# EAGLE schematic Driver (EAGLE 9.6.2)
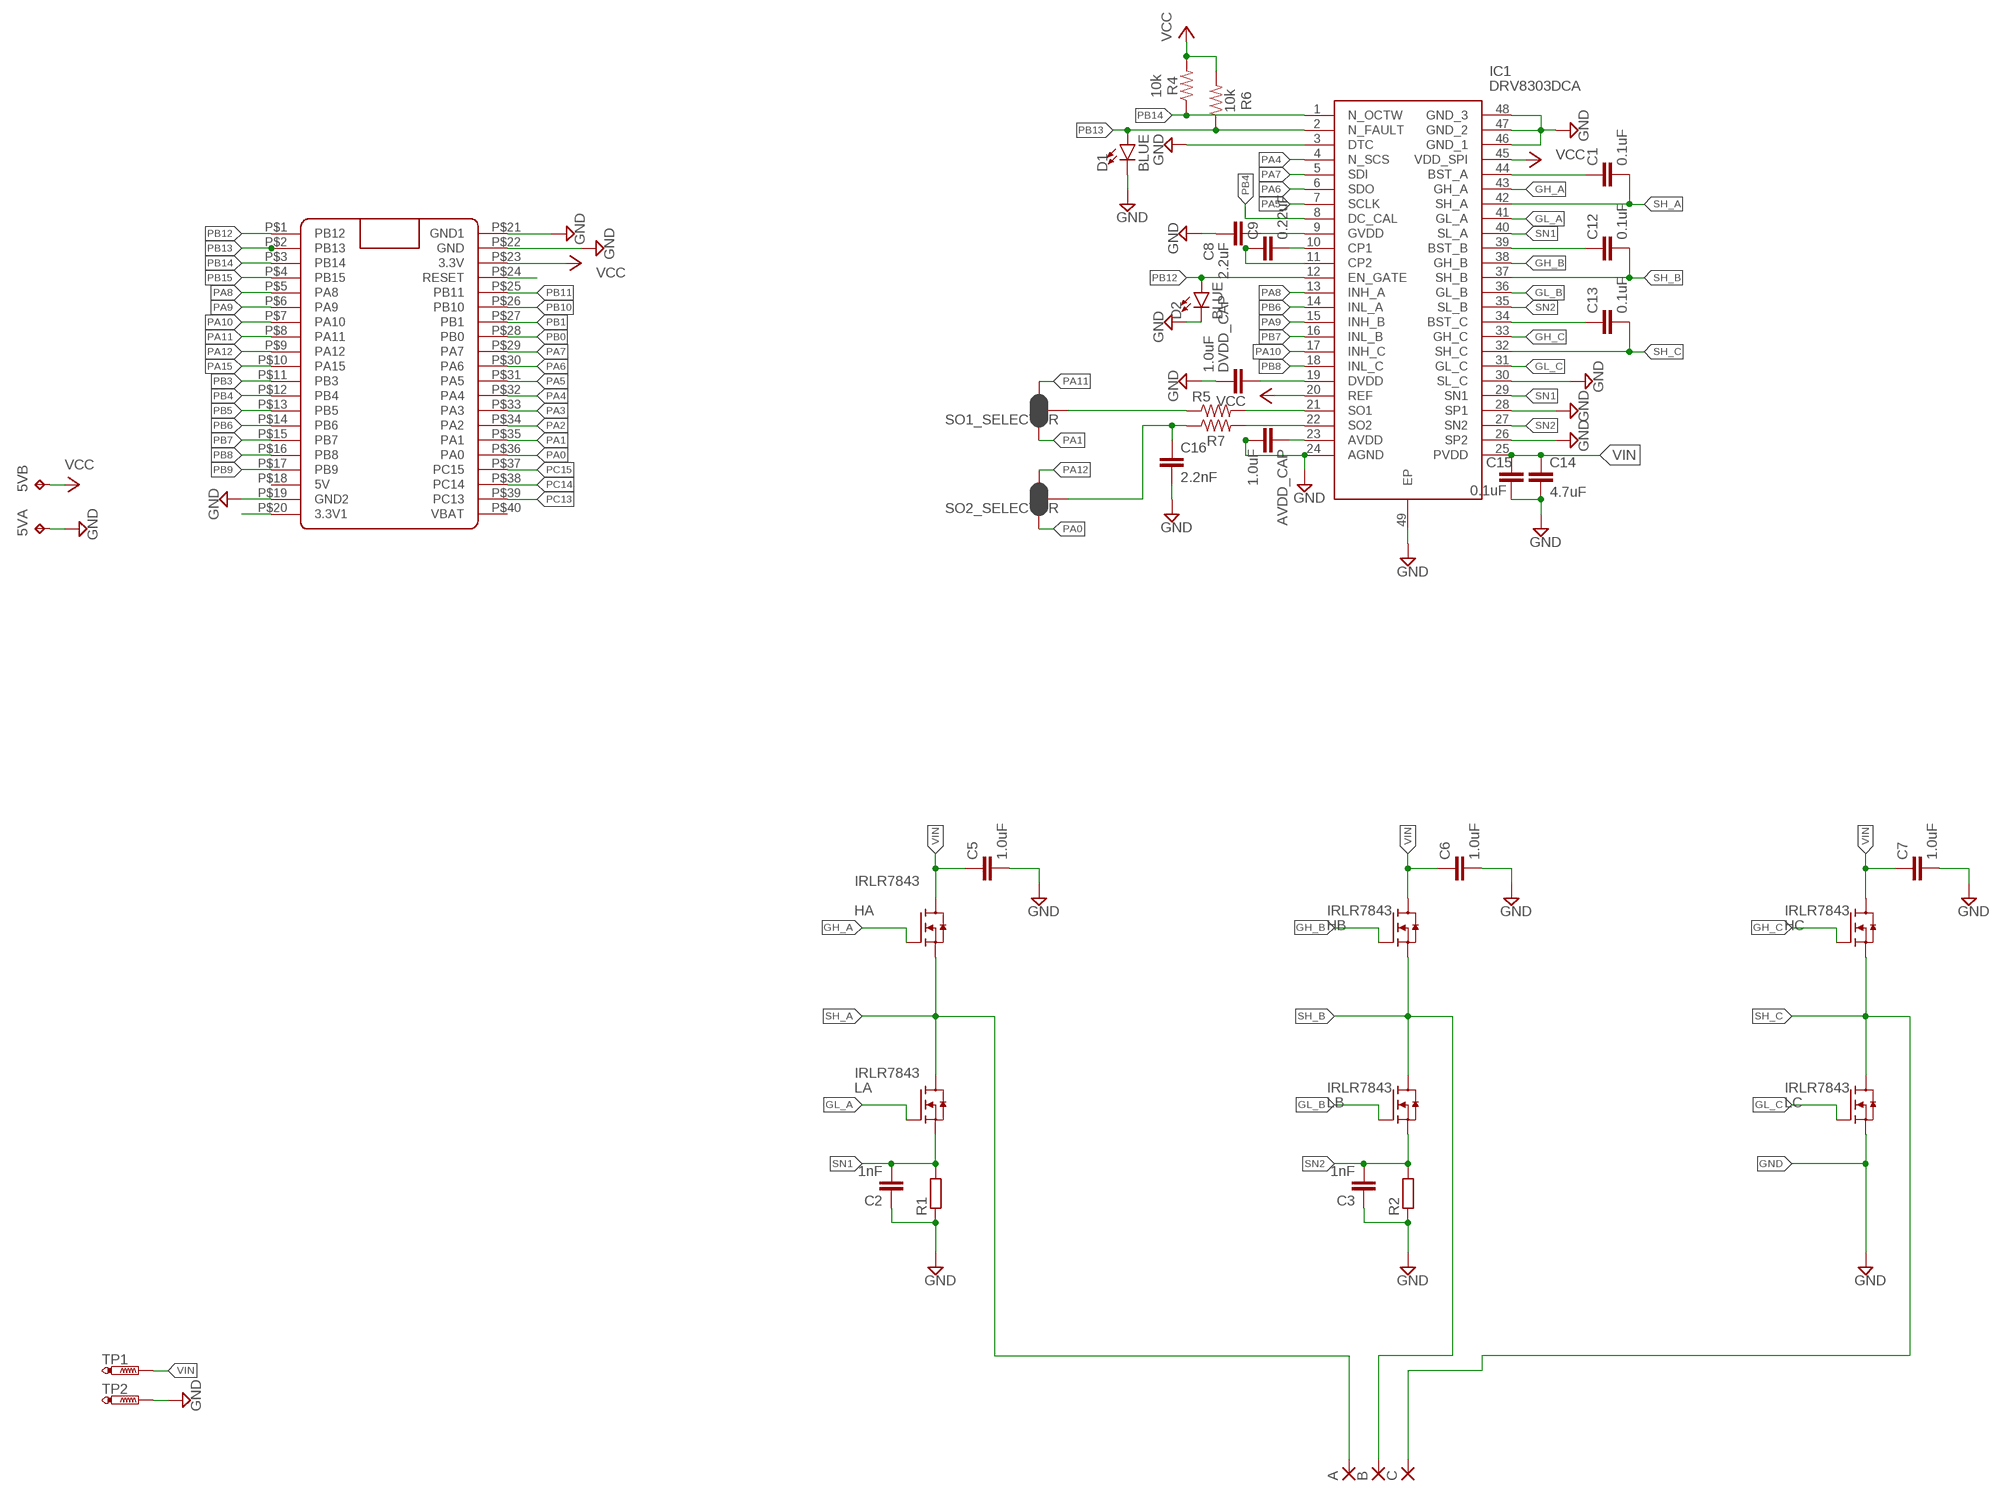
[diagram p0: schematic, sheet 1]

## Parts
5V  TP2P2-38-17  [P2-38-17]
A  SMD5  [SMD2,54-5,08]
AVDD_CAP  1.0uF  1.0UF-0603-16V-10%  [0603]
B  SMD5  [SMD2,54-5,08]
C  SMD5  [SMD2,54-5,08]
C1  0.1uF  0.1UF-0603-25V-(+80/-20%)  [0603]
C2  1nF  1.0NF/1000PF-0603-50V-10%  [0603]
C3  1nF  1.0NF/1000PF-0603-50V-10%  [0603]
C5  1.0uF  1.0UF-0603-16V-10%-X7R  [0603]
C6  1.0uF  1.0UF-0603-16V-10%-X7R  [0603]
C7  1.0uF  1.0UF-0603-16V-10%-X7R  [0603]
C8  2.2uF  2.2UF-0603-10V-20%  [0603]
C9  0.22uF  0.22UF-0603-25V-10%  [0603]
C12  0.1uF  0.1UF-0603-25V-(+80/-20%)  [0603]
C13  0.1uF  0.1UF-0603-25V-(+80/-20%)  [0603]
C14  4.7uF  4.7UF-0603-35V-(20%)  [0603]
C15  0.1uF  0.1UF-0603-25V-(+80/-20%)  [0603]
C16  2.2nF  2.2NF/2200PF-0603-50V-10%  [0603]
D1  BLUE  LED-BLUE0603  [LED-0603]
D2  BLUE  LED-BLUE0603  [LED-0603]
DVDD_CAP  1.0uF  1.0UF-0603-16V-10%  [0603]
HA  IRLR7843  [TO252]
HB  IRLR7843  [TO252]
HC  IRLR7843  [TO252]
IC1  DRV8303DCA  [SOP50P810X120-49N]
LA  IRLR7843  [TO252]
LB  IRLR7843  [TO252]
LC  IRLR7843  [TO252]
R1  R-EU_R2512  [R2512]
R2  R-EU_R2512  [R2512]
R4  10k  10KOHM-0603-1/10W-1%  [0603]
R5  0  0OHM-0603-1/10W  [0603]
R6  10k  10KOHM-0603-1/10W-1%  [0603]
R7  0  0OHM-0603-1/10W  [0603]
SO1_SELECTOR  JUMPER-SMT_3_2-NC_PASTE_SILK  [SMT-JUMPER_3_2-NC_PASTE_SILK]
SO2_SELECTOR  JUMPER-SMT_3_2-NC_PASTE_SILK  [SMT-JUMPER_3_2-NC_PASTE_SILK]
TP1  PTR1PAD1-20Y  [P1-20Y]
TP2  PTR1PAD1-20Y  [P1-20Y]
U$1  BLUE_PILLADVANCED  [BLUE_PILL_ADV]

## Nets
GH_A: HA.1(G) IC1.43(GH_A)
GH_B: HB.1(G) IC1.38(GH_B)
GH_C: HC.1(G) IC1.33(GH_C)
GL_A: IC1.41(GL_A) LA.1(G)
GL_B: IC1.36(GL_B) LB.1(G)
GL_C: IC1.31(GL_C) LC.1(G)
GND: 5V.TP-1 AVDD_CAP.2 C2.1 C3.1 C5.2 C6.2 C7.2 C8.2 C14.2 C15.2 C16.2 D1.C D2.C DVDD_CAP.1 IC1.3(DTC) IC1.24(AGND) IC1.26(SP2) IC1.28(SP1) IC1.30(SL_C) IC1.46(GND_1) IC1.47(GND_2) IC1.48(GND_3) IC1.49(EP) LC.2(S) R1.1 R2.1 TP2.TP U$1.P$19(GND2) U$1.P$21(GND1) U$1.P$22(GND)
N$1: IC1.21(SO1) R5.2
N$2: C1.1 IC1.44(BST_A)
N$3: IC1.22(SO2) R7.2
N$4: U$1.P$24(RESET)
N$9: C12.1 IC1.39(BST_B)
N$14: C13.1 IC1.34(BST_C)
N$32: C8.1 IC1.9(GVDD)
N$33: C9.2 IC1.10(CP1)
N$34: C9.1 IC1.11(CP2)
N$40: U$1.P$20(3.3V1)
N$43: DVDD_CAP.2 IC1.19(DVDD)
N$47: AVDD_CAP.1 IC1.23(AVDD)
PA0: SO2_SELECTOR.1 U$1.P$36(PA0)
PA1: SO1_SELECTOR.1 U$1.P$35(PA1)
PA2: U$1.P$34(PA2)
PA3: U$1.P$33(PA3)
PA4: IC1.4(N_SCS) U$1.P$32(PA4)
PA5: IC1.7(SCLK) U$1.P$31(PA5)
PA6: IC1.6(SDO) U$1.P$30(PA6)
PA7: IC1.5(SDI) U$1.P$29(PA7)
PA8: IC1.13(INH_A) U$1.P$5(PA8)
PA9: IC1.15(INH_B) U$1.P$6(PA9)
PA10: IC1.17(INH_C) U$1.P$7(PA10)
PA11: SO1_SELECTOR.3 U$1.P$8(PA11)
PA12: SO2_SELECTOR.3 U$1.P$9(PA12)
PA15: U$1.P$10(PA15)
PB0: U$1.P$28(PB0)
PB1: U$1.P$27(PB1)
PB3: U$1.P$11(PB3)
PB4: IC1.8(DC_CAL) U$1.P$12(PB4)
PB5: U$1.P$13(PB5)
PB6: IC1.14(INL_A) U$1.P$14(PB6)
PB7: IC1.16(INL_B) U$1.P$15(PB7)
PB8: IC1.18(INL_C) U$1.P$16(PB8)
PB9: U$1.P$17(PB9)
PB10: U$1.P$26(PB10)
PB11: U$1.P$25(PB11)
PB12: D2.A IC1.12(EN_GATE) U$1.P$1(PB12)
PB13: D1.A IC1.2(N_FAULT) R6.1 U$1.P$2(PB13)
PB14: IC1.1(N_OCTW) R4.1 U$1.P$3(PB14)
PB15: U$1.P$4(PB15)
PC13: U$1.P$39(PC13)
PC14: U$1.P$38(PC14)
PC15: U$1.P$37(PC15)
SH_A: A.1(P) C1.2 HA.2(S) IC1.42(SH_A) LA.3(D)
SH_B: B.1(P) C12.2 HB.2(S) IC1.37(SH_B) LB.3(D)
SH_C: C13.2 C.1(P) HC.2(S) IC1.32(SH_C) LC.3(D)
SN1: C2.2 IC1.29(SN1) IC1.40(SL_A) LA.2(S) R1.2
SN2: C3.2 IC1.27(SN2) IC1.35(SL_B) LB.2(S) R2.2
SO1: R5.1 SO1_SELECTOR.2
SO2: C16.1 R7.1 SO2_SELECTOR.2
VCC: 5V.TP-2 IC1.20(REF) IC1.45(VDD_SPI) R4.2 R6.2 U$1.P$23(3.3V)
VIN: C5.1 C6.1 C7.1 C14.1 C15.1 HA.3(D) HB.3(D) HC.3(D) IC1.25(PVDD) TP1.TP
Unconnected: U$1.P$18(5V) U$1.P$40(VBAT)

## Library data of the parts
5V = testpad:TP2: Test pad
A B C = wirepad:SMD5: SMD PAD
AVDD_CAP DVDD_CAP = SparkFun-Capacitors:1.0UF: 1µF ceramic capacitors A capacitor is a passive two-terminal electrical component used to store electrical energy temporarily in an electric field.; PROD_ID: CAP-00868
C1 C12 C13 C15 = SparkFun-Capacitors:0.1UF: 0.1µF ceramic capacitors A capacitor is a passive two-terminal electrical component used to store electrical energy temporarily in an electric field.; PROD_ID: CAP-00810
C2 C3 = SparkFun-Capacitors:1.0NF/1000PF: 1nF/1,000pF ceramic capacitors A capacitor is a passive two-terminal electrical component used to store electrical energy temporarily in an electric field.; PROD_ID: CAP-07886
C5-C7 = SparkFun-Capacitors:1.0UF: 1µF ceramic capacitors A capacitor is a passive two-terminal electrical component used to store electrical energy temporarily in an electric field.; PROD_ID: CAP-13930
C8 = SparkFun-Capacitors:2.2UF: 2.2µF ceramic capacitors A capacitor is a passive two-terminal electrical component used to store electrical energy temporarily in an electric field.; PROD_ID: CAP-07888
C9 = SparkFun-Capacitors:0.22UF: 0.22µF ceramic capacitors A capacitor is a passive two-terminal electrical component used to store electrical energy temporarily in an electric field.; PROD_ID: CAP-07822
C14 = SparkFun-Capacitors:4.7UF: 4.7µF ceramic capacitors A capacitor is a passive two-terminal electrical component used to store electrical energy temporarily in an electric field.; PROD_ID: CAP-14106
C16 = SparkFun-Capacitors:2.2NF/2200PF: 2.2nF/2,200pF ceramic capacitors A capacitor is a passive two-terminal electrical component used to store electrical energy temporarily in an electric field.; PROD_ID: CAP-07877
D1 D2 = SparkFun-LED:LED-BLUE: Blue SMD LED Used in manufacturing of various products at SparkFun Packages: 0603 - SMD 0603 package [Product Link] <http://www.digikey.com/product-detail/en/SMLE12BC7TT86/511-1589-2-ND/1641808> 1206 - SMD1206 package [Product Link] <http://www.digikey.com/product-detail/en/lite-on-inc/LTST-C150TBKT/160-1643-1-ND/573584> SparkFun Products: ESP8266 Thing-Dev Board <https://www.sparkfun.com/products/13711> RedBoard <https://www.sparkfun.com/products/12757>; PROD_ID: DIO-08575
HA HB HC LA LB LC = BLDC project:IRLR7843
IC1 = DRV8303DCA:DRV8303DCA: Texas Instruments DRV8303DCA, Three-Phase Gate Driver With Dual-Current Shunt Source: Datasheet <https://componentsearchengine.com/Datasheets/2/DRV8303DCA.pdf>; ARROW_PART_NUMBER: DRV8303DCA; ARROW_PRICE-STOCK: https://www.arrow.com/en/products/drv8303dca/texas-instruments; DESCRIPTION: Texas Instruments DRV8303DCA, Three-Phase Gate Driver With Dual-Current Shunt; HEIGHT: 1.2mm; MANUFACTURER_NAME: Texas Instruments; MANUFACTURER_PART_NUMBER: DRV8303DCA; MOUSER_PART_NUMBER: 595-DRV8303DCA; MOUSER_PRICE-STOCK: https://www.mouser.co.uk/ProductDetail/Texas-Instruments/DRV8303DCA?qs=igp4D3uu33KLowzNFy6WPA%3D%3D
R1 R2 = rcl:R-EU_: RESISTOR, European symbol; SPICEPREFIX: R
R4 R6 = SparkFun-Resistors:10KOHM: 10kΩ resistor A resistor is a passive two-terminal electrical component that implements electrical resistance as a circuit element. Resistors act to reduce current flow, and, at the same time, act to lower voltage levels within circuits. - Wikipedia; PROD_ID: RES-00824
R5 R7 = SparkFun-Resistors:0OHM: 0Ω resistor A resistor is a passive two-terminal electrical component that implements electrical resistance as a circuit element. Resistors act to reduce current flow, and, at the same time, act to lower voltage levels within circuits. - Wikipedia; PROD_ID: RES-08609
SO1_SELECTOR SO2_SELECTOR = SparkFun-Jumpers:JUMPER-SMT_3_2-NC_PASTE: Normally closed solder jumper (2 of 2 connections) This jumper has an aperture in the stencil to allow solder paste to bridge both connections. Both connections are normally closed (NC). Wick off the solder to open the connection(s). Reapply solder to reclose the connection(s).
TP1 TP2 = testpad:PTR1: TEST PIN
U$1 = BluePill:BLUE_PILL